# EAGLE design corridor_distal (EAGLE 6.5.0)
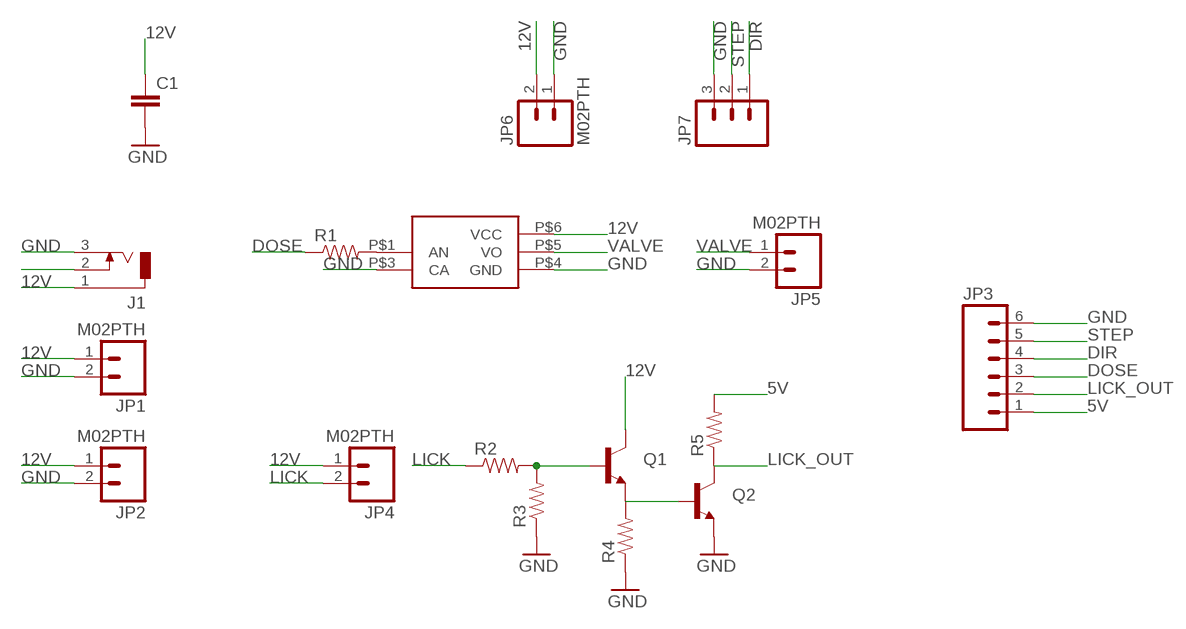
[diagram p0: schematic, sheet 1]

## Parts
C1  CAP1206  [1206]
J1  DCJ0303  [DCJ0303]
JP1  M02PTH  [1X02]
JP2  M02PTH  [1X02]
JP3  M06SIP  [1X06]
JP4  M02PTH  [1X02]
JP5  M02PTH  [1X02]
JP6  M02PTH  [1X02]
JP7  M03PTH  [1X03]
Q1  TRANSISTOR_NPNTO92  [TO-92]
Q2  TRANSISTOR_NPNTO92  [TO-92]
R1  RESISTOR1206  [1206]
R2  RESISTOR1206  [1206]
R3  RESISTOR1206  [1206]
R4  RESISTOR1206  [1206]
R5  RESISTOR1206  [1206]
U$1  TLP701  [TLP701]

## Nets
5V: JP3.1 R5.2
12V: C1.1 J1.1 JP1.1 JP2.1 JP4.1 JP6.2 Q1.3(C) U$1.P$6(VCC)
DIR: JP3.4 JP7.1
DOSE: JP3.3 R1.1
GND: C1.2 J1.3 JP1.2 JP2.2 JP3.6 JP5.2 JP6.1 JP7.3 Q2.1(E) R3.1 R4.1 U$1.P$3(CA) U$1.P$4(GND)
LICK: JP4.2 R2.1
LICK_OUT: JP3.2 Q2.3(C) R5.1
N$1: R1.2 U$1.P$1(AN)
N$2: J1.2
N$3: Q1.2(B) R2.2 R3.2
N$4: Q1.1(E) Q2.2(B) R4.2
STEP: JP3.5 JP7.2
VALVE: JP5.1 U$1.P$5(VO)

## Library data of the parts
C1 = SparkFun-Passives:CAP: Capacitor Standard 0603 ceramic capacitor, and 0.1" leaded capacitor.
J1 = con-jack:DCJ0303: DC POWER JACK Source: DCJ0303.pdf; OC_FARNELL: unknown; OC_NEWARK: unknown
JP1 JP2 JP4-JP6 = SparkFun-Connectors:M02: Standard 2-pin 0.1" header. Use with - straight break away headers ( PRT-00116) - right angle break away headers (PRT-00553) - swiss pins (PRT-00743) - machine pins (PRT-00117) - female headers (PRT-00115) Molex polarized connector foot print use with: PRT-08233 with associated crimp pins and housings. 2.54_SCREWTERM for use with PRT-10571. 3.5mm Screw Terminal footprints for PRT-08084 5mm Screw Terminal footprints for use with PRT-08433
JP3 = SparkFun-Connectors:M06: Header 6 Standard 6-pin 0.1" header. Use with straight break away headers (SKU : PRT-00116), right angle break away headers (PRT-00553), swiss pins (PRT-00743), machine pins (PRT-00117), and female headers (PRT-00115). Molex polarized connector foot print use with SKU : PRT-08094 with associated crimp pins and housings. NOTES ON THE VARIANTS LOCK and LOCK_LONGPADS... This footprint was designed to help hold the alignment of a through-hole component (i.e. 6-pin header) while soldering it into place. You may notice that each hole has been shifted either up or down by 0.005 of an inch from it's more standard position (which is a perfectly straight line). This slight alteration caused the pins (the squares in the middle) to touch the edges of the holes. Because they are alternating, it causes a "brace" to hold the component in place. 0.005 has proven to be the perfect amount of "off-center" position when using our standard breakaway headers. Although looks a little odd when you look at the bare footprint, once you have a header in there, the alteration is very hard to notice. Also,if you push a header all the way into place, it is covered up entirely on the bottom side. This idea of altering the position of holes to aid alignment will be further integrated into the Sparkfun Library for other footprints. It can help hold any component with 3 or more connection pins.
JP7 = SparkFun-Connectors:M03: Header 3 Standard 3-pin 0.1" header. Use with straight break away headers (SKU : PRT-00116), right angle break away headers (PRT-00553), swiss pins (PRT-00743), machine pins (PRT-00117), and female headers (PRT-00115). Molex polarized connector foot print use with SKU : PRT-08232 with associated crimp pins and housings.
Q1 Q2 = SparkFun-DiscreteSemi:TRANSISTOR_NPN: Generic NPN BJT MMBT2222A - TRANS-08049 (SOT-23, 1A 40V) MPSA42 - TRANS-09116 (SOT-23, 500mA 300V) MMBT5088LT1G - TRANS-11160 (SOT-23, 50 mA 30V)
R1-R5 = SparkFun-Passives:RESISTOR: Resistor Basic schematic elements and footprints for 0603, 1206, and PTH resistors.
U$1 = kimth:TLP701: TLP601 photocoupler Digikey: TLP701FCT-ND

## Board
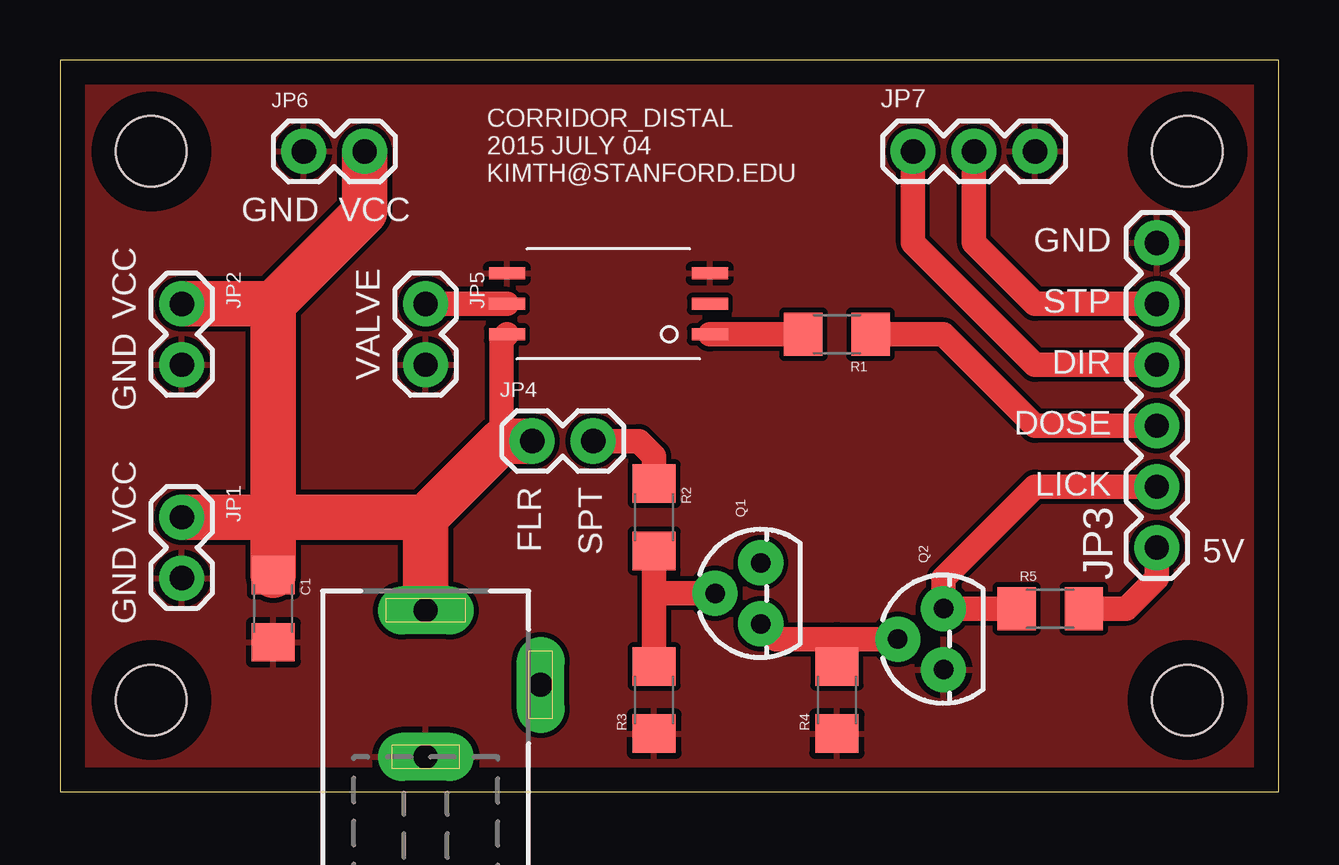
[diagram p1: board, top side]
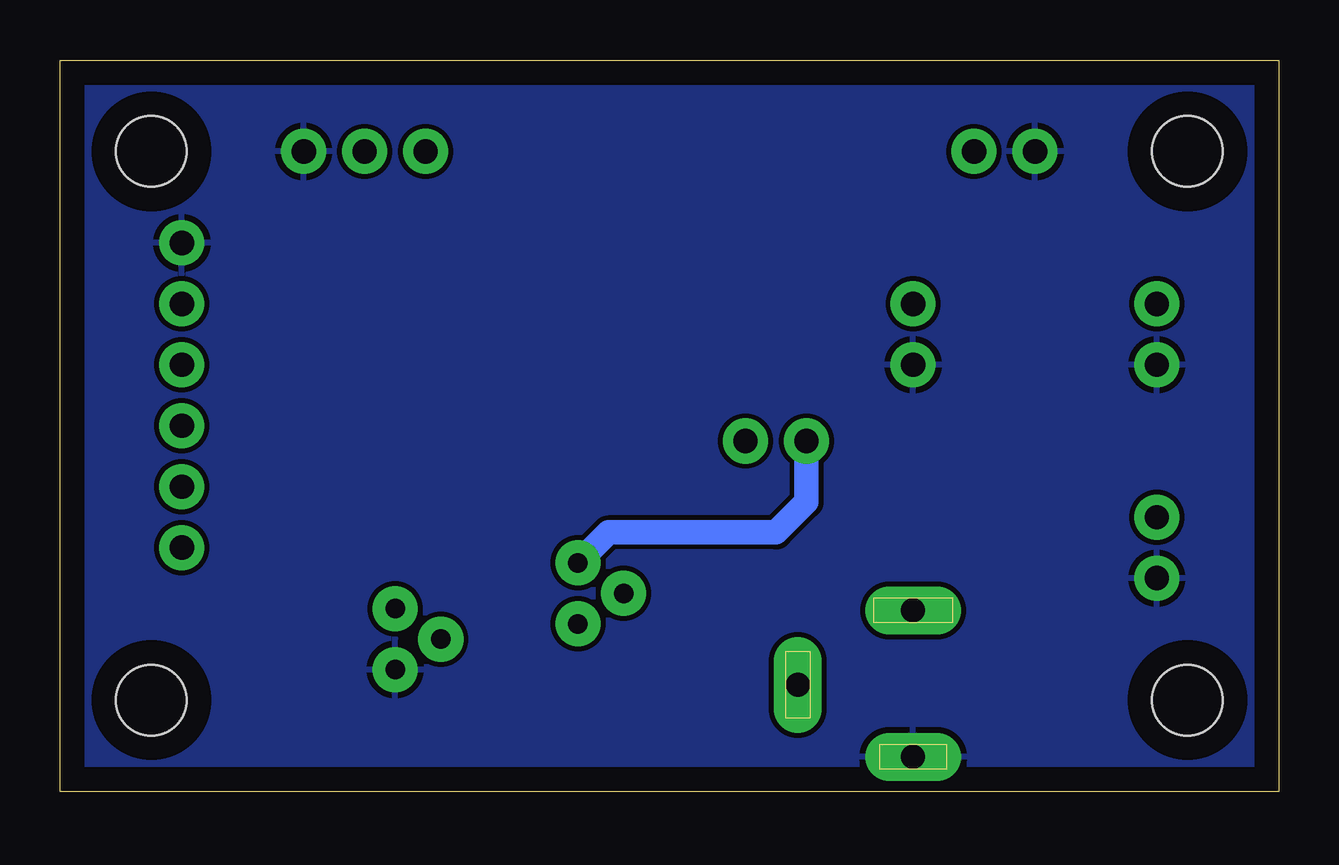
[diagram p2: board, bottom side, seen from below]

Size 50.8 x 30.48 mm. Coordinates in mm from the lower left corner, seen from the top.
Outline: 0,0 50.8,0 50.8,30.48 0,30.48 0,0
Copper layers (1*16): Top 0.035mm / dielectric 1.5mm / Bottom 0.035mm
Design rules "default": minimum track width 10mil, minimum drill 24mil, track to track 8mil, track to pad 8mil, pad to pad 8mil, via to via 8mil, smd to smd 8mil, copper to edge 40mil, drill to drill 8mil, minimum pad ring 10mil, minimum via ring 8mil, stop-mask expansion 4mil, vias tented up to drill 0mil, thermal gap 10mil
Holes 2.95 mm at 3.81,26.67 46.99,26.67 46.99,3.81 3.81,3.81

### Footprints (pad centres in the part's own frame; a part is rotated, then mirrored left to right if it is on the bottom)
1206 = smd 1.6 x 1.8: 1 -1.4,0; 2 1.4,0
DCJ0303 = drill 1 pad 2 long: 1 0,3.1; 2 4.8,0; 3 0,-3
1X02 = drill 1.016 pad 1.88: 1 0,0; 2 2.54,0
1X06 = drill 1.016 pad 1.88: 1 0,0; 2 2.54,0; 3 5.08,0; 4 7.62,0; 5 10.16,0; 6 12.7,0
1X03 = drill 1.016 pad 1.88: 1 0,0; 2 2.54,0; 3 5.08,0
TO-92 = drill 0.813 pad 1.88: 1 -1.27,0; 2 0,1.905; 3 1.27,0
TLP701 = smd 0.5 x 1.5: P$1 -1.27,-4.225; P$2 0,-4.225; P$3 1.27,-4.225; P$4 1.27,4.225; P$5 0,4.225; P$6 -1.27,4.225

### Placement (x,y rotation side)
C1  8.89,7.62 270 top
J1  15.24,4.45 0 top
JP1  5.08,11.43 270 top
JP2  5.08,20.32 270 top
JP3  45.72,10.16 90 top
JP4  19.68,14.61 0 top
JP5  15.24,20.32 270 top
JP6  10.16,26.67 0 top
JP7  35.56,26.67 0 top
Q1  29.21,8.26 90 top
Q2  36.83,6.35 90 top
R1  32.38,19.05 180 top
R2  24.77,11.43 270 top
R3  24.77,3.81 90 top
R4  32.38,3.81 90 top
R5  41.27,7.62 0 top
U$1  22.86,20.32 90 top

### Tracks (layer width: path | path; a pad name or v marks a point on that pad's centre or on a via)
5V
  Top 1.016: R5.2 44.45,7.62 45.72,8.89 JP3.1
12V
  Top 1.016: U$1.P$6 18.41,18.83 18.41,14.61
  Top 1.905: 8.89,11.43 JP1.1 | JP2.1 8.89,20.32 | 8.89,20.32 8.89,11.43 | 8.89,20.32 12.7,24.13 JP6.2 | 8.89,11.43 15.24,11.43 | J1.1 15.24,11.43 | C1.1 8.89,11.43 | 15.24,11.43 18.41,14.61 JP4.1
  Bottom 1.016: JP4.1 19.68,12.06 20.95,10.79 27.94,10.79 Q1.3
DIR
  Top 1.016: JP3.4 40.64,17.78 35.56,22.86 JP7.1
DOSE
  Top 1.016: JP3.3 40.64,15.24 36.83,19.05 R1.1
GND
  pour Top: 0,30.48 50.8,30.48 50.8,0 0,0
  pour Bottom: 0,30.48 50.8,30.48 50.8,0 0,0
LICK
  Top 1.016: JP4.2 24.13,14.61 24.77,13.97 R2.1
LICK_OUT
  Top 1.016: R5.1 Q2.3 36.83,8.89 40.64,12.7 JP3.2
N$1
  Top 1.016: R1.2 U$1.P$1
N$3
  Top 1.016: R2.2 24.77,8.26 | 24.77,8.26 R3.2 | Q1.2 24.77,8.26
N$4
  Top 1.016: Q1.1 29.84,6.35 32.38,6.35 | 32.38,6.35 Q2.2 | R4.2 32.38,6.35
STEP
  Top 1.016: JP3.5 40.64,20.32 38.1,22.86 JP7.2
VALVE
  Top 1.016: U$1.P$5 JP5.1

### Text on the board
tNames: GND | VCC | CORRIDOR_DISTAL / 2015 JULY 04 / KIMTH@STANFORD.EDU | GND | STP | VCC | DIR | VALVE | GND | DOSE | FLR | SPT | LICK | VCC | 5V | GND